# EAGLE schematic ArduFocuser V0.09 (EAGLE 6.3)
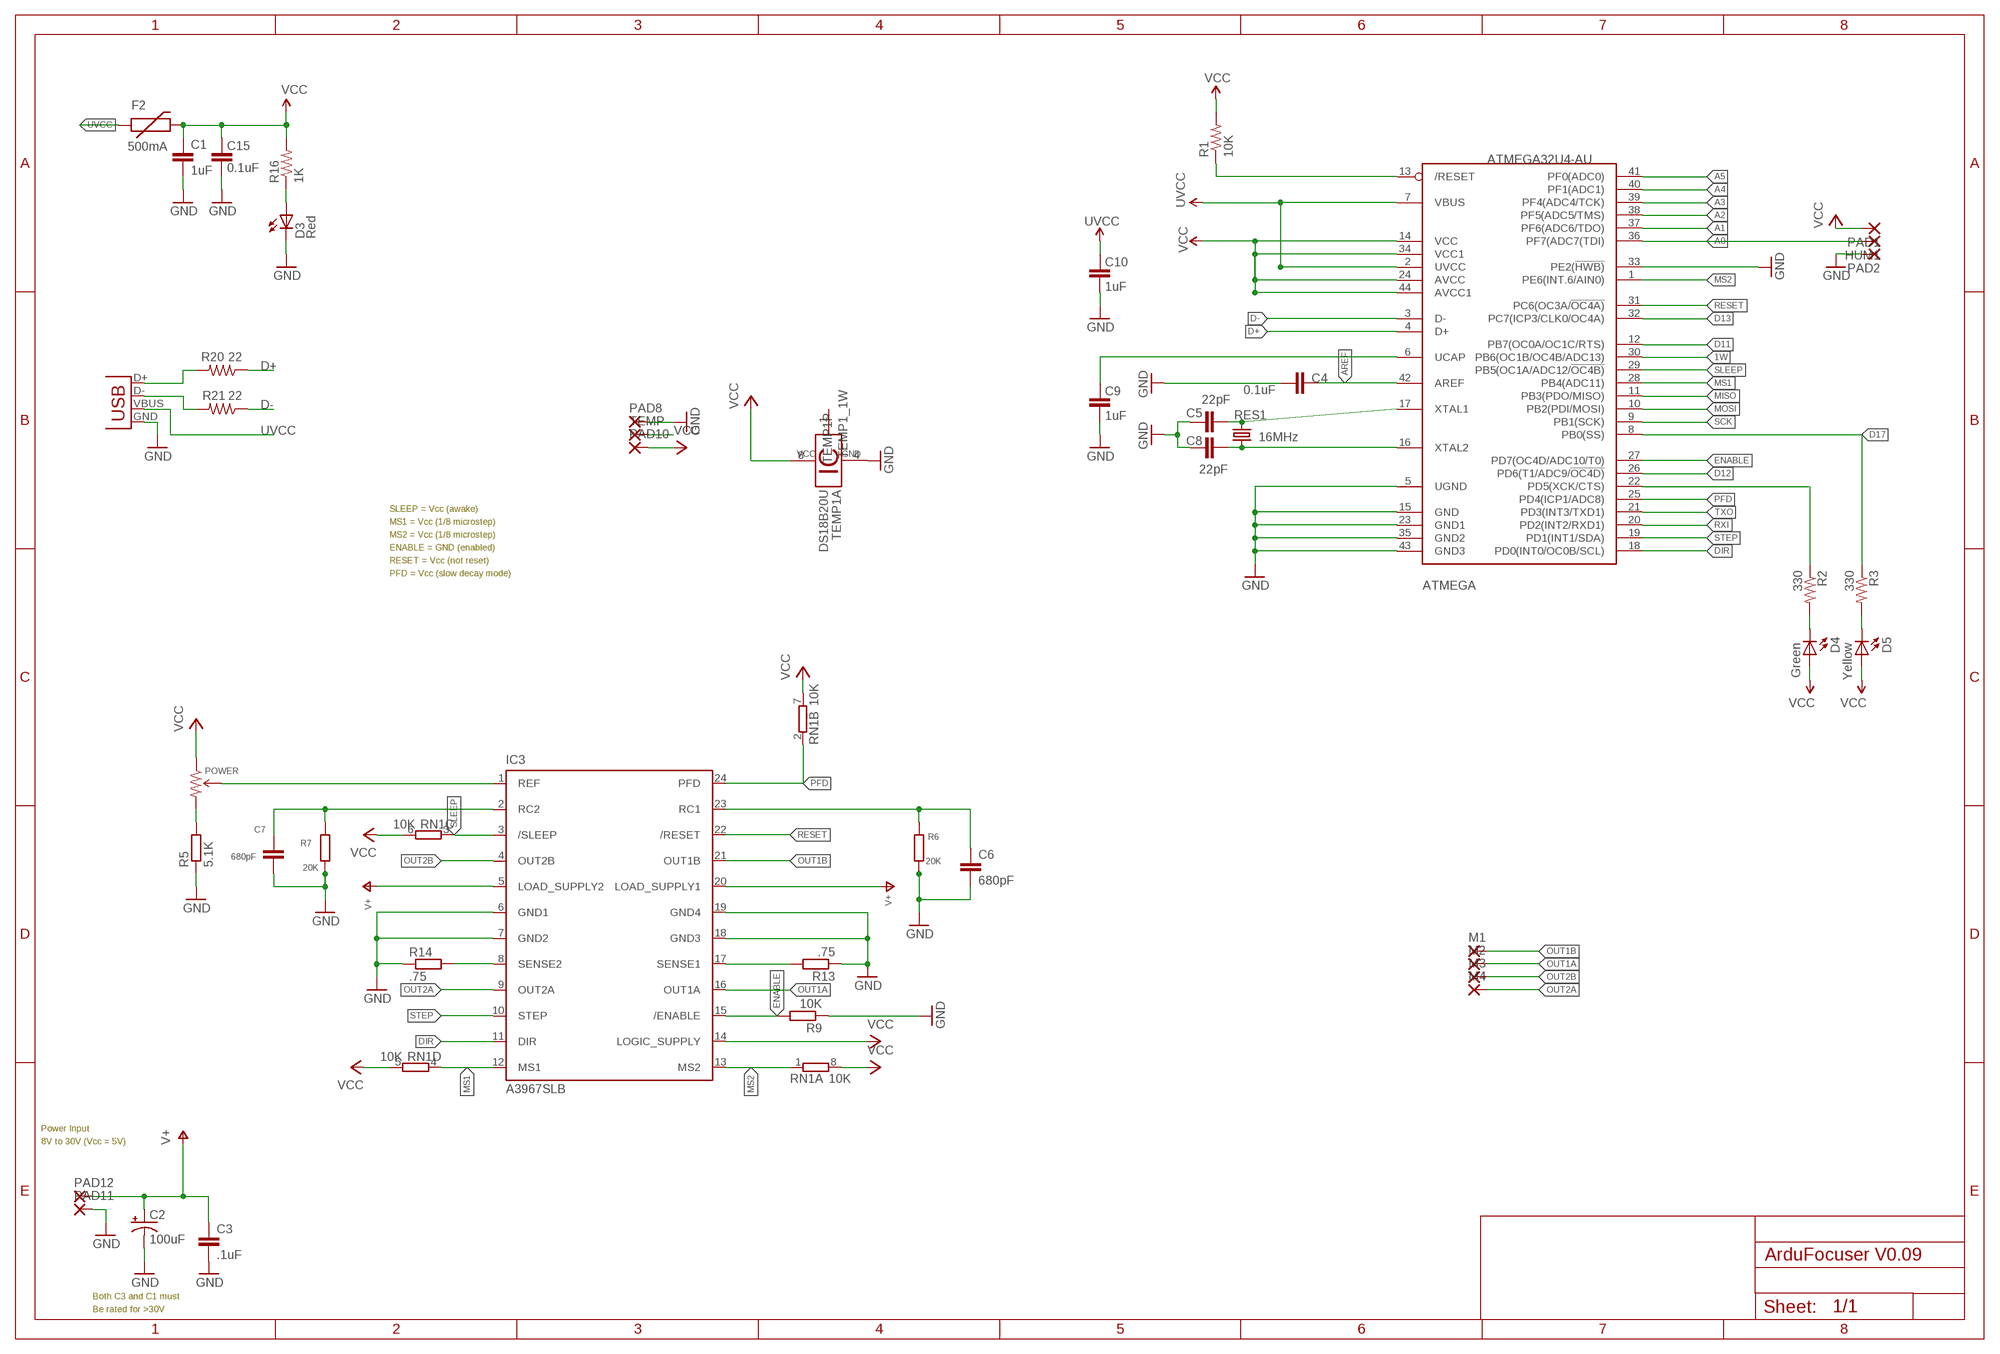
[diagram p0: schematic, sheet 1]

## Parts
ATMEGA  ATMEGA32U4-AU  [TQFP44]
C1  1uF  CAP0805  [0805]
C2  100uF  CPOL-USD  [PANASONIC_D@1]
C3  .1uF  C-EUC0805  [C0805]
C4  0.1uF  CAP0805  [0805]
C5  22pF  CAP0805  [0805]
C6  680pF  C-EUC0805  [C0805]
C7  680pF  C-EUC0805  [C0805]
C8  22pF  CAP0805  [0805]
C9  1uF  CAP0805  [0805]
C10  1uF  CAP0805  [0805]
C15  0.1uF  CAP0805  [0805]
D3  Red  LED1206  [LED-1206]
D4  Green  LED1206  [LED-1206]
D5  Yellow  LED1206  [LED-1206]
F2  500mA  PTCSMD  [PTC-1206]
HUM1  1,6/0,8  [1,6/0,8]
IC3  A3967SLB  [SO24W]
M1  1,6/0,8  [1,6/0,8]
M2  1,6/0,8  [1,6/0,8]
M3  1,6/0,8  [1,6/0,8]
M4  1,6/0,8  [1,6/0,8]
PAD1  1,6/0,8  [1,6/0,8]
PAD2  1,6/0,8  [1,6/0,8]
PAD8  1,6/0,8  [1,6/0,8]
PAD10  1,6/0,8  [1,6/0,8]
PAD11  2,15/1,0  [2,15/1,0]
PAD12  2,15/1,0  [2,15/1,0]
POWER  TRIMPOTSMD  [TRIMPOT-3MM]
R1  10K  RESISTOR0805-RES  [0805]
R2  330  RESISTOR0805-RES  [0805]
R3  330  RESISTOR0805-RES  [0805]
R5  5.1K  R-EU_R0805  [R0805]
R6  20K  R-EU_R0805  [R0805]
R7  20K  R-EU_R0805  [R0805]
R9  10K  R-EU_R0805  [R0805]
R13  .75  R-EU_R0805  [R0805]
R14  .75  R-EU_R0805  [R0805]
R16  1K  RESISTOR0805-RES  [0805]
R20  22  RESISTOR0805-RES  [0805]
R21  22  RESISTOR0805-RES  [0805]
RES1  16MHz  CRYSTAL5X3  [CRYSTAL-SMD-5X3]
RN1  10K  4R-N0603-ARC  [0603-ARC]
TEMP  1,6/0,8  [1,6/0,8]
TEMP1  DS18B20U  [UMAX8]
USB  USB-MICROB  [USB-MICROB]

## Nets
1W: ATMEGA.30(PB6(OC1B/OC4B/ADC13)) TEMP.1(P)
A0: ATMEGA.36(PF7(ADC7(TDI)) HUM1.1(P)
A1: ATMEGA.37(PF6(ADC6/TDO))
A2: ATMEGA.38(PF5(ADC5/TMS))
A3: ATMEGA.39(PF4(ADC4/TCK))
A4: ATMEGA.40(PF1(ADC1))
A5: ATMEGA.41(PF0(ADC0))
AREF: ATMEGA.42(AREF) C4.2
D11: ATMEGA.12(PB7(OC0A/OC1C/RTS))
D12: ATMEGA.26(PD6(T1/ADC9/!OC4D))
D13: ATMEGA.32(PC7(ICP3/CLK0/OC4A))
D17: ATMEGA.8(PB0(SS)) R3.1
D+: ATMEGA.4(D+) R20.1
D-: ATMEGA.3(D-) R21.1
DIR: ATMEGA.18(PD0(INT0/OC0B/SCL)) IC3.11(DIR)
ENABLE: ATMEGA.27(PD7(OC4D/ADC10/T0)) IC3.15(/ENABLE) R9.2
GND: ATMEGA.5(UGND) ATMEGA.15(GND) ATMEGA.23(GND1) ATMEGA.33(PE2(!HWB)) ATMEGA.35(GND2) ATMEGA.43(GND3) C1.2 C2.- C3.2 C4.1 C5.2 C6.2 C7.2 C8.2 C9.1 C10.1 C15.1 D3.C IC3.6(GND1) IC3.7(GND2) IC3.18(GND3) IC3.19(GND4) PAD2.1(P) PAD8.1(P) PAD11.1(P) R5.1 R6.1 R7.1 R9.1 R13.1 R14.1 TEMP1.4 USB.GND
MISO: ATMEGA.11(PB3(PDO/MISO))
MOSI: ATMEGA.10(PB2(PDI/MOSI))
MS1: ATMEGA.28(PB4(ADC11)) IC3.12(MS1) RN1.4
MS2: ATMEGA.1(PE6(INT.6/AIN0)) IC3.13(MS2) RN1.1
N$1: ATMEGA.16(XTAL2) C8.1 RES1.1
N$3: ATMEGA.17(XTAL1) C5.1 RES1.3
N$6: ATMEGA.6(UCAP) C9.2
N$7: R21.2 USB.D-
N$8: IC3.8(SENSE2) R14.2
N$9: IC3.17(SENSE1) R13.2
N$10: C7.1 IC3.2(RC2) R7.2
N$11: R20.2 USB.D+
N$13: C6.1 IC3.23(RC1) R6.2
N$14: IC3.1(REF) POWER.2(WIPER)
N$16: POWER.3(CW) R5.2
N$17: D5.C R3.2
N$18: D4.C R2.2
N$38: D3.A R16.1
OUT1A [MOTOR OUT]: IC3.16(OUT1A) M2.1(P)
OUT1B [MOTOR OUT]: IC3.21(OUT1B) M1.1(P)
OUT2A [MOTOR OUT]: IC3.9(OUT2A) M4.1(P)
OUT2B [MOTOR OUT]: IC3.4(OUT2B) M3.1(P)
PFD: ATMEGA.25(PD4(ICP1/ADC8)) IC3.24(PFD) RN1.2
RESET: ATMEGA.31(PC6(OC3A/!OC4A)) IC3.22(/RESET)
RESET1: ATMEGA.13(/RESET) R1.1
RXI: ATMEGA.20(PD2(INT2/RXD1))
SCK: ATMEGA.9(PB1(SCK))
SLEEP: ATMEGA.29(PB5(OC1A/ADC12/!OC4B)) IC3.3(/SLEEP) RN1.3
STEP: ATMEGA.19(PD1(INT1/SDA)) IC3.10(STEP)
TXLED2: ATMEGA.22(PD5(XCK/CTS)) R2.1
TXO: ATMEGA.21(PD3(INT3/TXD1))
UVCC [usbvcc]: ATMEGA.2(UVCC) ATMEGA.7(VBUS) C10.2 F2.1 USB.VBUS
V+ [power]: C2.+ C3.1 IC3.5(LOAD_SUPPLY2) IC3.20(LOAD_SUPPLY1) PAD12.1(P)
VCC [VCC]: ATMEGA.14(VCC) ATMEGA.24(AVCC) ATMEGA.34(VCC1) ATMEGA.44(AVCC1) C1.1 C15.2 D4.A D5.A F2.2 IC3.14(LOGIC_SUPPLY) PAD1.1(P) PAD10.1(P) POWER.1(CCW) R1.2 R16.2 RN1.5 RN1.6 RN1.7 RN1.8 TEMP1.8

## Notes on the sheet
- SLEEP = Vcc (awake)
- MS1 = Vcc (1/8 microstep)
- MS2 = Vcc (1/8 microstep)
- ENABLE = GND (enabled)
- RESET = Vcc (not reset)
- PFD = Vcc (slow decay mode)
- Power Input
- 8V to 30V (Vcc = 5V)
- Both C3 and C1 must
- Be rated for >30V

## Power pins joined to a net without a drawn wire
1W: TEMP1.1

## Library data of the parts
ATMEGA = adafruit:ATMEGA32U4: http://www.ladyada.net/library/eagle
C1 C4 C5 C8-C10 C15 = SparkFun:CAP: Capacitor Standard 0603 ceramic capacitor, and 0.1" leaded capacitor.
C2 = rcl:CPOL-US: POLARIZED CAPACITOR, American symbol
C3 C6 C7 = rcl:C-EU: CAPACITOR, European symbol
D3-D5 = SparkFun:LED: LEDs Standard schematic elements and footprints for 5mm, 3mm, 1206, and 0603 sized LEDs. 5mm - Spark Fun Electronics SKU : COM-00529 (and others)
F2 = SparkFun:PTC: Resettable Fuse PTC Resettable Fuse. Spark Fun Electronics SKU : COM-08357
HUM1 M1-M4 PAD1 PAD2 PAD8 PAD10 TEMP = wirepad:1,6/0,8: THROUGH-HOLE PAD
IC3 = Allegro:A3967SLB: ANALOG DEVICES
PAD11 PAD12 = wirepad:2,15/1,0: THROUGH-HOLE PAD
POWER = SparkFun:TRIMPOT
R1-R3 R16 R20 R21 = SparkFun:RESISTOR: Resistor Basic schematic elements and footprints for 0603, 1206, and PTH resistors.
R5-R7 R9 R13 R14 = rcl:R-EU_: RESISTOR, European symbol
RES1 = SparkFun:CRYSTAL: Crystals Various standard crystals. Proven footprints. Spark Fun Electronics SKU : COM-00534
RN1 = resistor-dil:4R-N: Array Chip Resistor Source: RS Component / Phycomp; OC_FARNELL: unknown; OC_NEWARK: unknown
TEMP1 = 1wire:DS18B20: Programmable Resolution Digital Thermometer This chip provides a onewire thermosensor with approx. 0.5°C accuracy. A programmable over/undertemperure alarm is available. The precision can be set from 9..12 bits. Notes: Vdd must be applied for accurate measurements at low temperatures, as the parasite power circuit otherwise heats the sensor. If parasite power is used, Vdd has to be connected to GND. The DS1822 is a low-cost thermometer chip, the DS18S20 is similar to the DS18B20, but with 9 Bit precision only. Author: Jan Kandziora <jjj@gmx.de>
USB = SparkFun:USB: USB Connectors USB-B-PTH is fully proven SKU : PRT-00139 USB-miniB is fully proven SKU : PRT-00587 USB-A-PCB is untested. USB-A-H is throughly reviewed, but untested. Spark Fun Electronics SKU : PRT-00437 USB-B-SMT is throughly reviewed, but untested. Needs silkscreen touching up. USB-A-S has not been used/tested USB-MB-H has not been used/tested

## Net classes
0 default: width 0.254 mm
1 power: width 0.762 mm
2 MOTOR OUT: width 0.508 mm
3 usbvcc: width 0.305 mm
4 aref: width 0.305 mm
5 VCC: width 0.305 mm